# Altium schematic sheet MCU.SchDoc: RP2040 MCU
size 420 x 297 mm; Engineer: Hardy Yu, Yuchen Lin, Nelson Mei; DocumentNumber: 1; Revision: A; SheetNumber: 1; SheetTotal: 3; Time: 2024-06-25
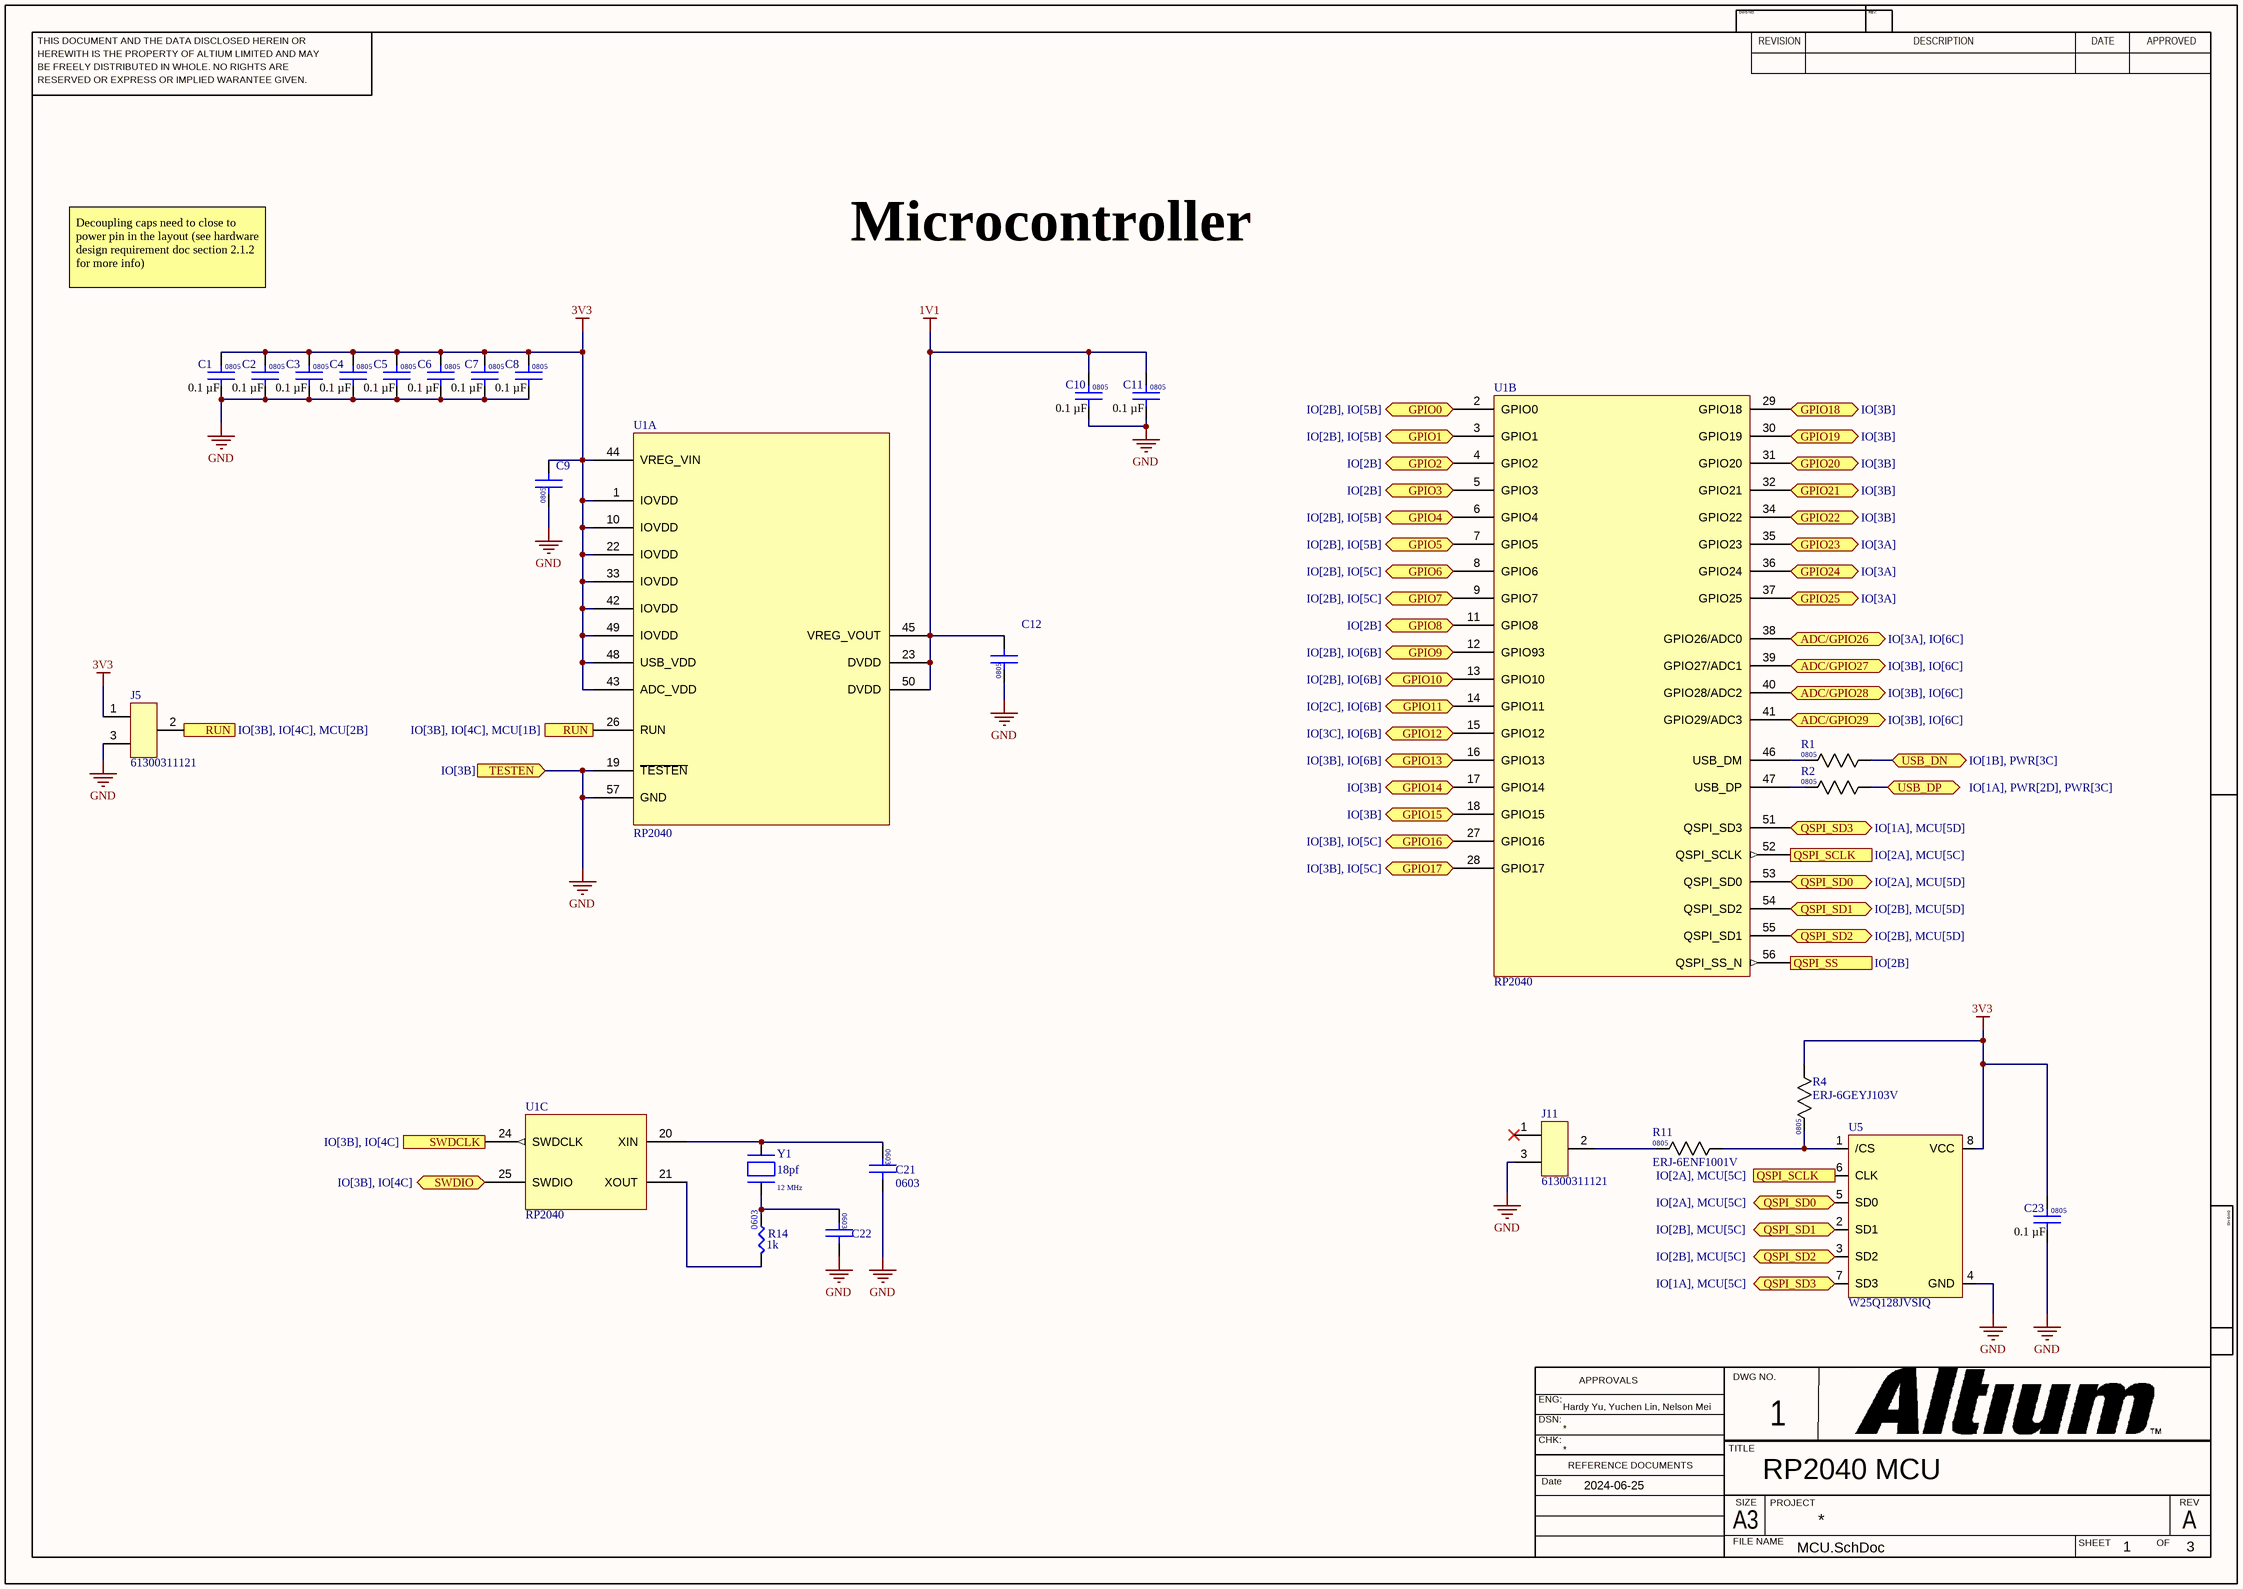
[diagram p0: MCU.SchDoc]

## Parts
C1  Capacitance: 0.1 µF  Package / Case: 0805  [CAP_CL21_SAM]  (hidden comment: C0805C104K4RAC7800)
C2  Capacitance: 0.1 µF  Package / Case: 0805  [CAP_CL21_SAM]  (hidden comment: C0805C104K4RAC7800)
C3  Capacitance: 0.1 µF  Package / Case: 0805  [CAP_CL21_SAM]  (hidden comment: C0805C104K4RAC7800)
C4  Capacitance: 0.1 µF  Package / Case: 0805  [CAP_CL21_SAM]  (hidden comment: C0805C104K4RAC7800)
C5  Capacitance: 0.1 µF  Package / Case: 0805  [CAP_CL21_SAM]  (hidden comment: C0805C104K4RAC7800)
C6  Capacitance: 0.1 µF  Package / Case: 0805  [CAP_CL21_SAM]  (hidden comment: C0805C104K4RAC7800)
C7  Capacitance: 0.1 µF  Package / Case: 0805  [CAP_CL21_SAM]  (hidden comment: C0805C104K4RAC7800)
C8  Capacitance: 0.1 µF  Package / Case: 0805  [CAP_CL21_SAM]  (hidden comment: C0805C104K4RAC7800)
C9  CL21B105KAFNNNE  [CAP_CL21_SAM]  (value not drawn)
C10  Capacitance: 0.1 µF  Package / Case: 0805  [CAP_CL21_SAM]  (hidden comment: C0805C104K4RAC7800)
C11  Capacitance: 0.1 µF  Package / Case: 0805  [CAP_CL21_SAM]  (hidden comment: C0805C104K4RAC7800)
C12  CL21B105KAFNNNE  [CAP_CL21_SAM]  (value not drawn)
C21  Size: 0603  [CAPC17595_87N_KEM]  (hidden comment: C0603C220J5GACTU)
C22  C0603C220J5GACTU  [CAPC17595_87N_KEM]  (value not drawn)
C23  Capacitance: 0.1 µF  Package / Case: 0805  [CAP_CL21_SAM]  (hidden comment: C0805C104K4RAC7800)
J5  61300311121  [61300311121]
J11  61300311121  [61300311121]
R1  ERJ-6ENF27R4V  [RESC1608X50N]  (value not drawn)
R2  ERJ-6ENF27R4V  [RESC1608X50N]  (value not drawn)
R4  ERJ-6GEYJ103V  [RESC1608X50N]
R11  ERJ-6ENF1001V  [RESC1608X50N]
R14  value 1k  [.RES_0603-Footprint-1]  (hidden comment: RC0603FR-071KL)
U1  RP2040  [QFN40P700X700X90-57N]  (parts A,B,C of 3)
U5  W25Q128JVSIQ  [SOIC127P790X216-8N]
Y1  Load Capacitance: 18pf  Frequency: 12 MHz  [XTAL_ABLS2-12.000MHZ-D4Y-T]  (hidden comment: ABLS2-12.000MHZ-D4Y-T)

## Ports
ADC/GPIO26 (bidir, see IO[3A], IO[6C]), ADC/GPIO27 (bidir, see IO[3B], IO[6C]), ADC/GPIO28 (bidir, see IO[3B], IO[6C]), ADC/GPIO29 (bidir, see IO[3B], IO[6C]), GPIO0 (bidir, see IO[2B], IO[5B]), GPIO1 (bidir, see IO[2B], IO[5B]), GPIO2 (bidir, see IO[2B]), GPIO3 (bidir, see IO[2B]), GPIO4 (bidir, see IO[2B], IO[5B]), GPIO5 (bidir, see IO[2B], IO[5B]), GPIO6 (bidir, see IO[2B], IO[5C]), GPIO7 (bidir, see IO[2B], IO[5C]), GPIO8 (bidir, see IO[2B]), GPIO9 (bidir, see IO[2B], IO[6B]), GPIO10 (bidir, see IO[2B], IO[6B]), GPIO11 (bidir, see IO[2C], IO[6B]), GPIO12 (bidir, see IO[3C], IO[6B]), GPIO13 (bidir, see IO[3B], IO[6B]), GPIO14 (bidir, see IO[3B]), GPIO15 (bidir, see IO[3B]), GPIO16 (bidir, see IO[3B], IO[5C]), GPIO17 (bidir, see IO[3B], IO[5C]), GPIO18 (bidir, see IO[3B]), GPIO19 (bidir, see IO[3B]), GPIO20 (bidir, see IO[3B]), GPIO21 (bidir, see IO[3B]), GPIO22 (bidir, see IO[3B]), GPIO23 (bidir, see IO[3A]), GPIO24 (bidir, see IO[3A]), GPIO25 (bidir, see IO[3A]), QSPI_SCLK (out, see IO[2A], MCU[5C]), QSPI_SD0 (bidir, see IO[2A], MCU[5C]), QSPI_SD0 (bidir, see IO[2A], MCU[5D]), QSPI_SD1 (bidir, see IO[2B], MCU[5C]), QSPI_SD1 (bidir, see IO[2B], MCU[5D]), QSPI_SD2 (bidir, see IO[2B], MCU[5C]), QSPI_SD2 (bidir, see IO[2B], MCU[5D]), QSPI_SD3 (bidir, see IO[1A], MCU[5C]), QSPI_SD3 (bidir, see IO[1A], MCU[5D]), QSPI_SS (out, see IO[2B]), RUN (in, see IO[3B], IO[4C], MCU[1B]), RUN (out, see IO[3B], IO[4C], MCU[2B]), SWDCLK (out, see IO[3B], IO[4C]), SWDIO (bidir, see IO[3B], IO[4C]), TESTEN (in, see IO[3B]), USB_DN (bidir, see IO[1B], PWR[3C]), USB_DP (bidir, see IO[1A], PWR[2D], PWR[3C])

## Nets
1V1: C10.2 C11.2 C12.2 U1.23(DVDD) U1.45(VREG_VOUT) U1.50(DVDD)
3V3: C1.2 C2.2 C3.2 C4.2 C5.2 C6.2 C7.2 C8.2 C9.2 C23.2 J5.1 R4.1 U1.1(IOVDD) U1.10(IOVDD) U1.22(IOVDD) U1.33(IOVDD) U1.42(IOVDD) U1.43(ADC_VDD) U1.44(VREG_VIN) U1.48(USB_VDD) U1.49(IOVDD) U5.8(VCC)
GND: C1.1 C2.1 C3.1 C4.1 C5.1 C6.1 C7.1 C8.1 C9.1 C10.1 C11.1 C12.1 C21.2 C22.2 C23.1 J5.3 J11.3 U1.19(~{TESTEN}) U1.57(GND) U5.4(GND) ; port TESTEN
ADC/GPIO26: U1.38(GPIO26/ADC0) ; port ADC/GPIO26
ADC/GPIO27: U1.39(GPIO27/ADC1) ; port ADC/GPIO27
ADC/GPIO28: U1.40(GPIO28/ADC2) ; port ADC/GPIO28
ADC/GPIO29: U1.41(GPIO29/ADC3) ; port ADC/GPIO29
GPIO0: U1.2(GPIO0) ; port GPIO0
GPIO1: U1.3(GPIO1) ; port GPIO1
GPIO2: U1.4(GPIO2) ; port GPIO2
GPIO3: U1.5(GPIO3) ; port GPIO3
GPIO4: U1.6(GPIO4) ; port GPIO4
GPIO5: U1.7(GPIO5) ; port GPIO5
GPIO6: U1.8(GPIO6) ; port GPIO6
GPIO7: U1.9(GPIO7) ; port GPIO7
GPIO8: U1.11(GPIO8) ; port GPIO8
GPIO9: U1.12(GPIO93) ; port GPIO9
GPIO10: U1.13(GPIO10) ; port GPIO10
GPIO11: U1.14(GPIO11) ; port GPIO11
GPIO12: U1.15(GPIO12) ; port GPIO12
GPIO13: U1.16(GPIO13) ; port GPIO13
GPIO14: U1.17(GPIO14) ; port GPIO14
GPIO15: U1.18(GPIO15) ; port GPIO15
GPIO16: U1.27(GPIO16) ; port GPIO16
GPIO17: U1.28(GPIO17) ; port GPIO17
GPIO18: U1.29(GPIO18) ; port GPIO18
GPIO19: U1.30(GPIO19) ; port GPIO19
GPIO20: U1.31(GPIO20) ; port GPIO20
GPIO21: U1.32(GPIO21) ; port GPIO21
GPIO22: U1.34(GPIO22) ; port GPIO22
GPIO23: U1.35(GPIO23) ; port GPIO23
GPIO24: U1.36(GPIO24) ; port GPIO24
GPIO25: U1.37(GPIO25) ; port GPIO25
QSPI_SCLK: U1.52(QSPI_SCLK) U5.6(CLK) ; port QSPI_SCLK
QSPI_SD0: U1.53(QSPI_SD0) U5.5(SD0) ; port QSPI_SD0
QSPI_SD1: U1.54(QSPI_SD2) U5.2(SD1) ; port QSPI_SD1
QSPI_SD2: U1.55(QSPI_SD1) U5.3(SD2) ; port QSPI_SD2
QSPI_SD3: U1.51(QSPI_SD3) U5.7(SD3) ; port QSPI_SD3
QSPI_SS: U1.56(QSPI_SS_N) ; port QSPI_SS
RUN: J5.2 U1.26(RUN) ; port RUN
SWDCLK: U1.24(SWDCLK) ; port SWDCLK
SWDIO: U1.25(SWDIO) ; port SWDIO
USB_DN: R1.1 ; port USB_DN
USB_DP: R2.1 ; port USB_DP
NetC21_1: C21.1 U1.20(XIN) Y1.2
NetC22_1: C22.1 R14.2 Y1.1
NetJ11_2: J11.2 R11.2
NetR1_2: R1.2 U1.46(USB_DM)
NetR2_2: R2.2 U1.47(USB_DP)
NetR4_2: R4.2 R11.1 U5.1(/CS)
NetR14_1: R14.1 U1.21(XOUT)

Not connected (* = marked no-connect by the designer): J11 1*

## Notes on the sheet
- Microcontroller
- Decoupling caps need to close to power pin in the layout (see hardware design requirement doc section 2.1.2 for more info)
- THIS DOCUMENT AND THE DATA DISCLOSED HEREIN OR
- HEREWITH IS THE PROPERTY OF ALTIUM LIMITED AND MAY
- DWG NO:
- REVISION
- REV:
- DESCRIPTION
- DATE
- APPROVED
- BE FREELY DISTRIBUTED IN WHOLE. NO RIGHTS ARE
- RESERVED OR EXPRESS OR IMPLIED WARANTEE GIVEN.
- ENG:
- APPROVALS
- DWG NO.
- DSN:
- CHK:
- REFERENCE DOCUMENTS
- TITLE
- Date
- A3
- FILE NAME
- SIZE
- PROJECT
- SHEET
- OF
- REV
- (in symbol CL21B105KAFNNNE) 0805
- (in symbol ERJ-6ENF27R4V) 0805
- (in symbol ERJ-6ENF1001V) 0805
- (in symbol ERJ-6GEYJ103V) 0805

## Library data of the parts
C1-C8 C10 C11 C23 = C0805C104K4RAC7800: 0.1 µF ±10% 16V Ceramic Capacitor X7R 0805 (2012 Metric); Mfr_Name: KEMET; Voltage - Rated: 16V; ComponentLink1Description: Digikey; ComponentLink1URL: https://www.digikey.ca/en/products/detail/kemet/C0805C104K4RAC7800/411166
C9 C12 = CL21B105KAFNNNE: 1 µF ±10% 25V Ceramic Capacitor X7R 0805 (2012 Metric); Mfr_Name: Samsung Electro-Mechanics; Voltage - Rated: 25V; ComponentLink1Description: Digikey; ComponentLink1URL: https://www.digikey.ca/en/products/detail/samsung-electro-mechanics/CL21B105KAFNNNE/3886724
C21 C22 = C0603C220J5GACTU: 22 pF ±5% 50V Ceramic Capacitor C0G, NP0 0603 (1608 Metric); Mfr_Name: Kemet; Voltage: 50V; Tolerance: 5%
  C22: Size: 0603
J5 J11 = 61300311121: CONN HEADER VERT 3POS 2.54MM; Number of positions: 3; Connector Type: Header; Contact Type: Male Pin
R1 R2 = ERJ-6ENF27R4V: 27.4 Ohms ±1% 0.125W, 1/8W Chip Resistor 0805 (2012 Metric) Automotive AEC-Q200 Thick Film; Mfr_Name: Panasonic; Resistance: 27.4Ohms; Tolerance: ±1%; Power (Watts): 0.125W, 1/8W; ComponentLink1Description: Digikey; ComponentLink1URL: https://www.digikey.ca/en/products/detail/panasonic-electronic-components/ERJ-6ENF27R4V/110977
R4 = ERJ-6GEYJ103V: 10 kOhms ±5% 0.125W, 1/8W Chip Resistor 0805 (2012 Metric) Automotive AEC-Q200 Thick Film; Mfr_Name: Panasonic; Resistance: 10 kOhms; Tolerance: ±5%; Power (Watts): 0.125W, 1/8W; ComponentLink1Description: Digikey; ComponentLink1URL: https://www.digikey.ca/en/products/detail/panasonic-electronic-components/ERJ-6GEYJ103V/83062
R11 = ERJ-6ENF1001V: 1 kOhms ±1% 0.125W, 1/8W Chip Resistor 0805 (2012 Metric) Automotive AEC-Q200 Thick Film; Mfr_Name: Panasonic; Resistance: 1 kOhms; Tolerance: ±1%; Power (Watts): 0.125W, 1/8W; ComponentLink1Description: Digikey; ComponentLink1URL: https://www.digikey.ca/en/products/detail/panasonic-electronic-components/ERJ-6ENF1001V/111281
R14 = CMP-009-00012-3: RES 1k OHM 1% 1/10W 0603; Power: 1/10W; Case/Package: 0603
U1 = RP2040: RP2040 Chip for RPI development board; Manufacturer Product Number: SC0914(7); Mfr: Raspberry Pi; Voltage - Supply (Vcc/Vdd): 1.8V ~ 3.3V; Program Memory Type: External Program Memory; ComponentLink1Description: DataSheet; ComponentLink1URL: https://datasheets.raspberrypi.com/rp2040/rp2040-datasheet.pdf; ComponentLink2Description: minimal-design-example; ComponentLink2URL: https://datasheets.raspberrypi.com/rp2040/rp2040-datasheet.pdf; ComponentLink3Description: Digikey; ComponentLink3URL: https://www.digikey.ca/en/products/detail/raspberry-pi/SC0914-7/14306009; Package / Case: 56-VFQFN Exposed Pad; Mounting Type: Surface Mount
U5 = W25Q128JVSIQ: FLASH - NOR Memory IC 128Mb (16M x 8) SPI - Quad I/O, QPI, DTR 133 MHz 8-SOIC; MF: Winbond Electronics; Memory Interface: QSPI; Price: None; Purchase-URL: https://pricing.snapeda.com/search/part/W25Q128JVSIQ/?ref=eda; Check_prices: https://www.snapeda.com/parts/W25Q128JVSIQ/Winbond+Electronics/view-part/?ref=eda; MP: W25Q128JVSIQ; Package: SOIC-8 Winbond; SnapEDA_Link: https://www.snapeda.com/parts/W25Q128JVSIQ/Winbond+Electronics/view-part/?ref=snap; Availability: In Stock; ComponentLink1Description: Digikey; ComponentLink1URL: https://www.digikey.ca/en/products/detail/winbond-electronics/W25Q128JVSIQ/5803943
Y1 = ABLS2-12.000MHZ-D4Y-T: HC/49US (AT49) LOW PROFILE SURFACE MOUNT MICROPROCESSOR CRYSTAL; MF: Abracon; Frequency Tolerance: 30 ppm; ESR: 50R; Purchase-URL: https://pricing.snapeda.com/search/part/ABLS2-12.000MHZ-D4Y-T/?ref=eda; Package: HC49/US Abracon; MP: ABLS2-12.000MHZ-D4Y-T; Value: *; Price: None; Availability: In Stock; SnapEDA_Link: https://www.snapeda.com/parts/ABLS2-12.000MHZ-D4Y-T/Abracon+LLC/view-part/?ref=snap; Check_prices: https://www.snapeda.com/parts/ABLS2-12.000MHZ-D4Y-T/Abracon+LLC/view-part/?ref=eda; Temperature: X5R